# EAGLE design rf-synthesizer (EAGLE 7.5.0)
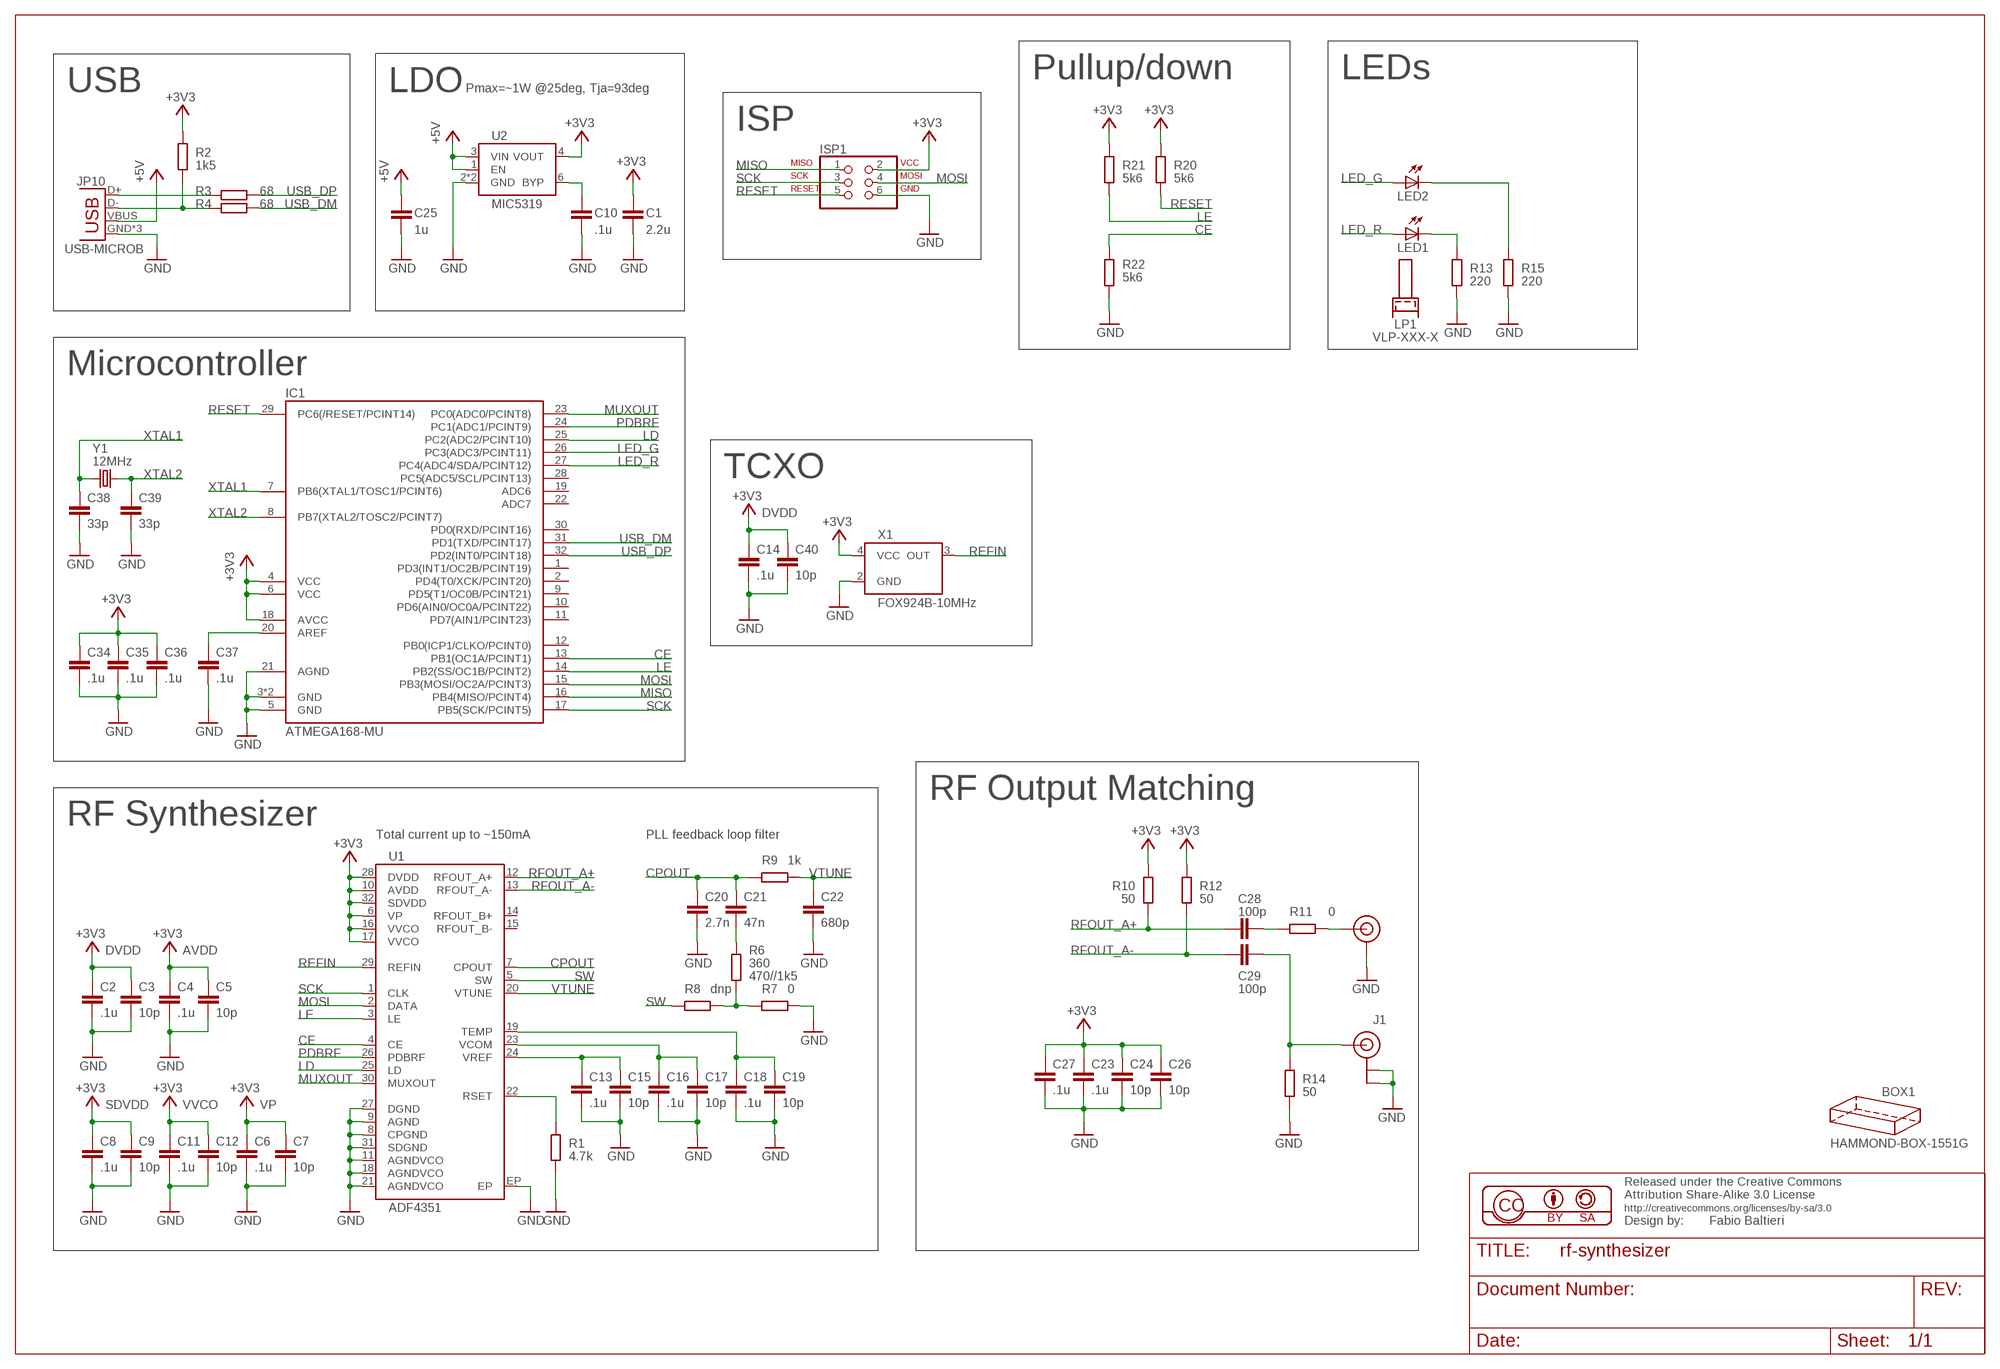
[diagram p0: schematic, sheet 1]

## Parts
BOX1  HAMMOND-BOX-1551G  [1551G]
C1  2.2u  C0603  [0603]
C2  .1u  C0603  [0603]
C3  10p  C0603  [0603]
C4  .1u  C0603  [0603]
C5  10p  C0603  [0603]
C6  .1u  C0603  [0603]
C7  10p  C0603  [0603]
C8  .1u  C0603  [0603]
C9  10p  C0603  [0603]
C10  .1u  C0603  [0603]
C11  .1u  C0603  [0603]
C12  10p  C0603  [0603]
C13  .1u  C0603  [0603]
C14  .1u  C0603  [0603]
C15  10p  C0603  [0603]
C16  .1u  C0603  [0603]
C17  10p  C0603  [0603]
C18  .1u  C0603  [0603]
C19  10p  C0603  [0603]
C20  2.7n  C0603  [0603]
C21  47n  C0603  [0603]
C22  680p  C0603  [0603]
C23  .1u  C0603  [0603]
C24  10p  C0603  [0603]
C25  1u  C0603  [0603]
C26  10p  C0603  [0603]
C27  .1u  C0603  [0603]
C28  100p  C0603  [0603]
C29  100p  C0603  [0603]
C34  .1u  C0603  [0603]
C35  .1u  C0603  [0603]
C36  .1u  C0603  [0603]
C37  .1u  C0603  [0603]
C38  33p  C0603  [0603]
C39  33p  C0603  [0603]
C40  10p  C0603  [0603]
IC1  ATMEGA168-MU  [MLF32-TH]
ISP1  ISP-AVR910PTH  [2X03]
J1  U.FL  [U.FL]
J$2  SMA_EDGEB  [SMA-EDGE-2]
JP10  USB-MICROB  [USB-MICROB]
LED1  LEDSML0805  [SML0805]
LED2  LEDSML0805  [SML0805]
LP1  VLP-XXX-X  [VLP-XXX-X]
R1  4.7k  R0603  [0603]
R2  1k5  R0603  [0603]
R3  68  R0603  [0603]
R4  68  R0603  [0603]
R6  360  R0603  [0603]
R7  0  R0603  [0603]
R8  dnp  R0603  [0603]
R9  1k  R0603  [0603]
R10  50  R0603  [0603]
R11  0  R0603  [0603]
R12  50  R0603  [0603]
R13  220  R0603  [0603]
R14  50  R0603  [0603]
R15  220  R0603  [0603]
R20  5k6  R0603  [0603]
R21  5k6  R0603  [0603]
R22  5k6  R0603  [0603]
U1  ADF4351  [LFCSP32]
U2  MIC5319  LDO-5PIN  [MLF6-2X2]
X1  FOX924B-10MHz  OSCILLATOR  [OSC-5X3.2]
Y1  12MHz  CRYSTAL5X3  [CRYSTAL-SMD-5X3]

## Nets
+3V3: C1.1 C2.1 C3.1 C4.1 C5.1 C6.1 C7.1 C8.1 C9.1 C11.1 C12.1 C14.1 C23.1 C24.1 C26.1 C27.1 C34.1 C35.1 C36.1 C40.1 IC1.4(VCC) IC1.6(VCC) IC1.18(AVCC) ISP1.2 R2.1 R10.1 R12.1 R20.1 R21.1 U1.6(VP) U1.10(AVDD) U1.16(VVCO) U1.17(VVCO) U1.28(DVDD) U1.32(SDVDD) U2.4(VOUT) X1.4(VCC)
+5V: C25.1 JP10.VBUS U2.1(EN) U2.3(VIN)
CE: IC1.13(PB1(OC1A/PCINT1)) R22.2 U1.4(CE)
CPOUT: C20.1 C21.1 R9.1 U1.7(CPOUT)
GND: C1.2 C2.2 C3.2 C4.2 C5.2 C6.2 C7.2 C8.2 C9.2 C10.2 C11.2 C12.2 C13.2 C14.2 C15.2 C16.2 C17.2 C18.2 C19.2 C20.2 C22.2 C23.2 C24.2 C25.2 C26.2 C27.2 C34.2 C35.2 C36.2 C37.2 C38.2 C39.2 C40.2 IC1.3(GND) IC1.5(GND) IC1.21(AGND) IC1.TH(GND) ISP1.6 J1.P$1(GND) J1.P$2(GND) J$2.M1(GND) J$2.M2(GND) J$2.M3(GND) J$2.M4(GND) JP10.GND JP10.MT1(GND) JP10.MT2(GND) R1.2 R7.2 R13.1 R14.2 R15.1 R22.1 U1.8(CPGND) U1.9(AGND) U1.11(AGNDVCO) U1.18(AGNDVCO) U1.21(AGNDVCO) U1.27(DGND) U1.31(SDGND) U1.EP U2.2(GND) U2.TH(GND) X1.2(GND)
LD: IC1.25(PC2(ADC2/PCINT10)) U1.25(LD)
LE: IC1.14(PB2(SS/OC1B/PCINT2)) R21.2 U1.3(LE)
LED_G: IC1.26(PC3(ADC3/PCINT11)) LED2.A
LED_R: IC1.27(PC4(ADC4/SDA/PCINT12)) LED1.A
MISO: IC1.16(PB4(MISO/PCINT4)) ISP1.1
MOSI: IC1.15(PB3(MOSI/OC2A/PCINT3)) ISP1.4 U1.2(DATA)
MUXOUT: IC1.23(PC0(ADC0/PCINT8)) U1.30(MUXOUT)
N$1: JP10.D+ R3.1
N$2: C28.2 R11.1
N$3: LED1.C R13.2
N$4: R1.1 U1.22(RSET)
N$5: R6.2 R7.1 R8.2
N$6: C21.2 R6.1
N$7: JP10.D- R2.2 R4.1
N$8: C10.1 U2.6(BYP)
N$9: J$2.FEED R11.2
N$10: LED2.C R15.2
N$12: C29.2 J1.P$3(SIGNAL) R14.1
N$14: C37.1 IC1.20(AREF)
PDBRF: IC1.24(PC1(ADC1/PCINT9)) U1.26(PDBRF)
REFIN: U1.29(REFIN) X1.3(OUT)
RESET: IC1.29(PC6(/RESET/PCINT14)) ISP1.5 R20.2
RFOUT_A+: C28.1 R10.2 U1.12(RFOUT_A+)
RFOUT_A-: C29.1 R12.2 U1.13(RFOUT_A-)
SCK: IC1.17(PB5(SCK/PCINT5)) ISP1.3 U1.1(CLK)
SW: R8.1 U1.5(SW)
TEMP: C18.1 C19.1 U1.19(TEMP)
USB_DM: IC1.31(PD1(TXD/PCINT17)) R4.2
USB_DP: IC1.32(PD2(INT0/PCINT18)) R3.2
VCOM: C16.1 C17.1 U1.23(VCOM)
VREF: C13.1 C15.1 U1.24(VREF)
VTUNE: C22.1 R9.2 U1.20(VTUNE)
XTAL1: C38.1 IC1.7(PB6(XTAL1/TOSC1/PCINT6)) Y1.1
XTAL2: C39.1 IC1.8(PB7(XTAL2/TOSC2/PCINT7)) Y1.3
Unconnected: IC1.1(PD3(INT1/OC2B/PCINT19)) IC1.2(PD4(T0/XCK/PCINT20)) IC1.9(PD5(T1/OC0B/PCINT21)) IC1.10(PD6(AIN0/OC0A/PCINT22)) IC1.11(PD7(AIN1/PCINT23)) IC1.12(PB0(ICP1/CLKO/PCINT0)) IC1.19(ADC6) IC1.22(ADC7) IC1.28(PC5(ADC5/SCL/PCINT13)) IC1.30(PD0(RXD/PCINT16)) U1.14(RFOUT_B+) U1.15(RFOUT_B-)

## Notes on the sheet
- Pullup/down | LEDs
- USB | LDO | Pmax=~1W @25deg, Tja=93deg
- ISP
- Microcontroller
- TCXO
- DVDD
- RF Output Matching
- RF Synthesizer
- Total current up to ~150mA | PLL feedback loop filter
- DVDD | AVDD
- 470//1k5
- SDVDD | VVCO | VP

## Library data of the parts
BOX1 = hammond:HAMMOND-BOX: Hammond Project boxes Hammond 1551 Transluscent Blue 50x35x20mm 1551GTBU http://www.hammondmfg.com/pdf/1551G.pdf Hammond 1551 Transluscent Blue 50x50x20mm 1551RTBU http://www.hammondmfg.com/pdf/1551R.pdf Hammond 1551 Transluscent Blue 60x35x20mm 1551HTBU http://www.hammondmfg.com/pdf/1551H.pdf Hammond 1551 Transluscent Blue 80x40x20mm 1551KTBU http://www.hammondmfg.com/pdf/1551K.pdf Hammond 1591 Transluscent Blue 100x51x22m m 1591XXATBU http://www.hammondmfg.com/pdf/1591XXA.pdf
C1-C29 C34-C40 = balto:C: Capacitor
IC1 = balto:ATMEGA168
ISP1 = balto:ISP-AVR910: PIN HEADER
J1 = SparkFun-Connectors:U.FL: SMD antenna connector- WRL-09144; PROD_ID: CONN-09193
J$2 = balto:SMA_EDGE: SMA Antenna Connector End launch SMA connector.
JP10 = SparkFun-Connectors:USB: USB Connectors USB-B-PTH is fully proven SKU : PRT-00139/CONN-08278 USB-miniB is fully proven SKU : PRT-00587 USB-A-PCB is untested. USB-A-H is throughly reviewed, but untested. Spark Fun Electronics SKU : PRT-00437 USB-B-SMT is throughly reviewed, but untested. Needs silkscreen touching up. USB-A-S has not been used/tested USB-MB-H has not been used/tested USB-MICROB has been used. CONN-09505; PROD_ID: CONN-09505
LED1 LED2 = led:LED: LED OSRAM: - CHIPLED LG R971, LG N971, LY N971, LG Q971, LY Q971, LO R971, LY R971 LH N974, LH R974 LS Q976, LO Q976, LY Q976 LO Q996 - Hyper CHIPLED LW Q18S LB Q993, LB Q99A, LB R99A - SideLED LS A670, LO A670, LY A670, LG A670, LP A670 LB A673, LV A673, LT A673, LW A673 LH A674 LY A675 LS A676, LA A676, LO A676, LY A676, LW A676 LS A679, LY A679, LG A679 - Hyper Micro SIDELED® LS Y876, LA Y876, LO Y876, LY Y876 LT Y87S - SmartLED LW L88C, LW L88S LB L89C, LB L89S, LG L890 LS L89K, LO L89K, LY L89K LS L896, LA L896, LO L896, LY L896 - TOPLED LS T670, LO T670, LY T670, LG T670, LP T670 LSG T670, LSP T670, LSY T670, LOP T670, LYG T670 LG T671, LOG T671, LSG T671 LB T673, LV T673, LT T673, LW T673 LH T674 LS T676, LA T676, LO T676, LY T676, LB T676, LH T676, LSB T676, LW T676 LB T67C, LV T67C, LT T67C, LS T67K, LO T67K, LY T67K, LW E67C LS E67B, LA E67B, LO E67B, LY E67B, LB E67C, LV E67C, LT E67C LW T67C LS T679, LY T679, LG T679 LS T770, LO T770, LY T770, LG T770, LP T770 LB T773, LV T773, LT T773, LW T773 LH T774 LS E675, LA E675, LY E675, LS T675 LS T776, LA T776, LO T776, LY T776, LB T776 LHGB T686 LT T68C, LB T68C - Hyper Mini TOPLED® LB M676 - Mini TOPLED Santana® LG M470 LS M47K, LO M47K, LY M47K Source: http://www.osram.convergy.de LUXEON: - LUMILED® LXK2-PW12-R00, LXK2-PW12-S00, LXK2-PW14-U00, LXK2-PW14-V00 LXK2-PM12-R00, LXK2-PM12-S00, LXK2-PM14-U00 LXK2-PE12-Q00, LXK2-PE12-R00, LXK2-PE12-S00, LXK2-PE14-T00, LXK2-PE14-U00 LXK2-PB12-K00, LXK2-PB12-L00, LXK2-PB12-M00, LXK2-PB14-N00, LXK2-PB14-P00, LXK2-PB14-Q00 LXK2-PR12-L00, LXK2-PR12-M00, LXK2-PR14-Q00, LXK2-PR14-R00 LXK2-PD12-Q00, LXK2-PD12-R00, LXK2-PD12-S00 LXK2-PH12-R00, LXK2-PH12-S00 LXK2-PL12-P00, LXK2-PL12-Q00, LXK2-PL12-R00 Source: www.luxeon.com KINGBRIGHT: KA-3528ASYC Source: www.kingbright.com
LP1 = balto:VLP-XXX-X: Bivar Light Pipe
R1-R4 R6-R15 R20-R22 = balto:R: Resistor
U1 = balto:ADF4351: Wideband Synthesizer with Integrated VCO
U2 = balto:LDO-5PIN: Generic 5 pin single fixed output LDO
X1 = balto:OSCILLATOR: Oscillator
Y1 = SparkFun-FreqCtrl:CRYSTAL: Various standard crystals. Proven footprints.; PROD_ID: XTAL-08218

## Board
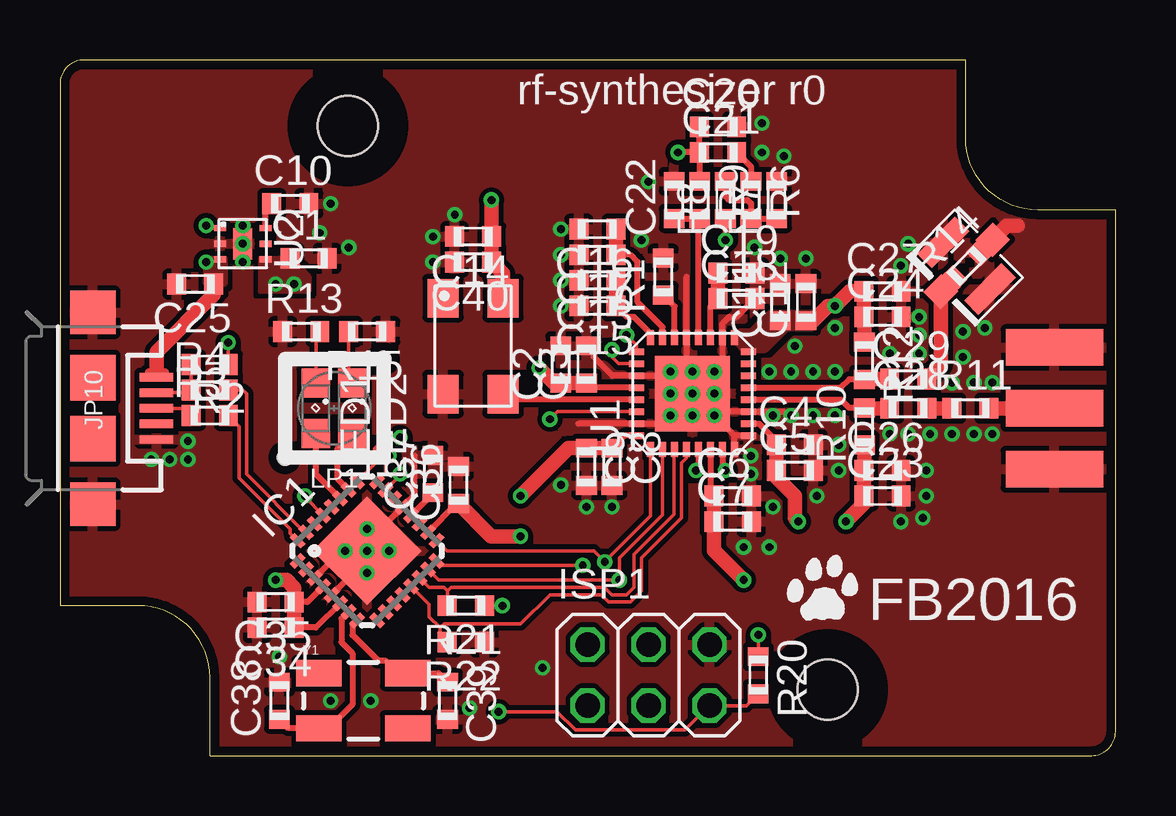
[diagram p1: board, top side]
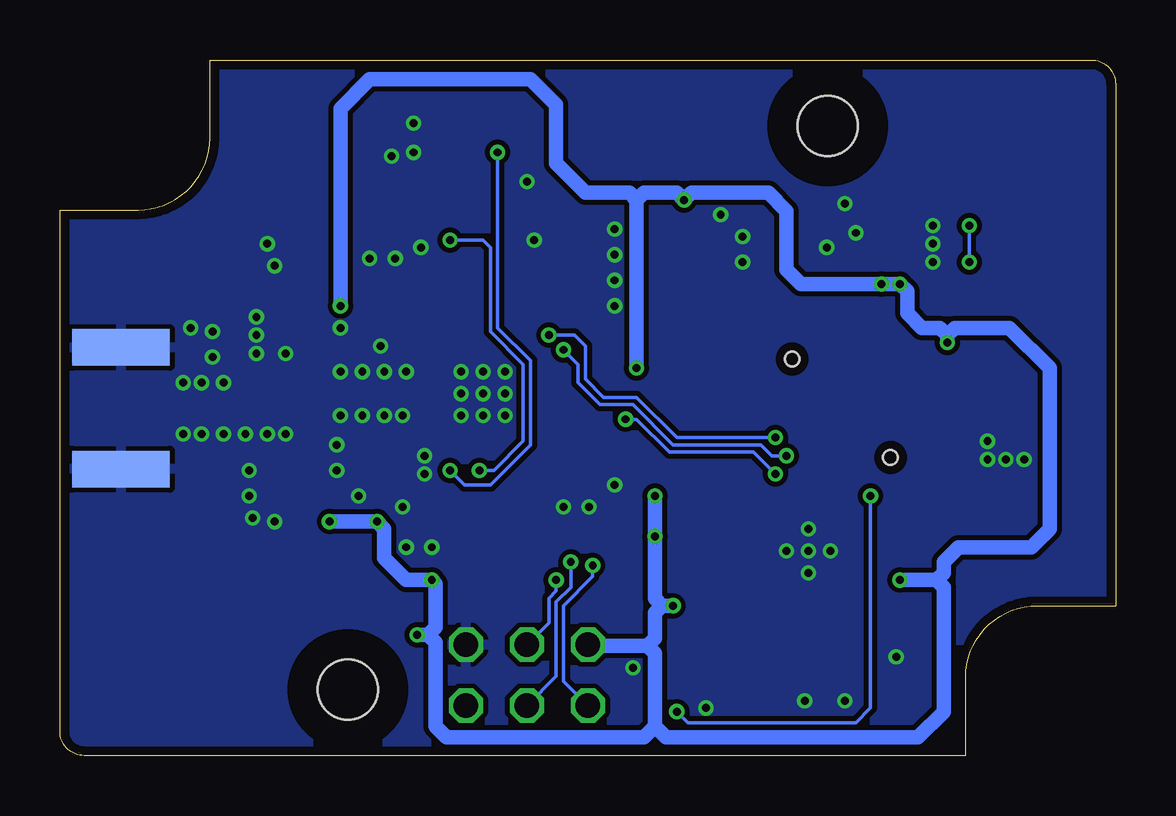
[diagram p2: board, bottom side, seen from below]

Size 44 x 29 mm. Coordinates in mm from the lower left corner, seen from the top.
Copper layers (1*16): Top 0.035mm / dielectric 1.5mm / Bottom 0.035mm
Design rules "balto": minimum track width 6mil, minimum drill 13mil, track to track 6mil, track to pad 6mil, pad to pad 6mil, via to via 6mil, smd to smd 6mil, copper to edge 15mil, drill to drill 6mil, minimum pad ring 6mil, minimum via ring 6mil, stop-mask expansion 2mil, vias tented up to drill 20mil, thermal gap 8mil

### Footprints (pad centres in the part's own frame; a part is rotated, then mirrored left to right if it is on the bottom)
1551G = hole 2.5: 32,2.75; 12,26.25
0603 = smd 0.787 x 0.864: 1 -0.774,0; 2 0.774,0
MLF32-TH = smd 0.65 x 0.29: 1 -2.35,1.75; 2 -2.35,1.25; 3 -2.35,0.75; 4 -2.35,0.25; 5 -2.35,-0.25; 6 -2.35,-0.75; 7 -2.35,-1.25; 8 -2.35,-1.75; 17 2.35,-1.75; 18 2.35,-1.25; 19 2.35,-0.75; 20 2.35,-0.25; 21 2.35,0.25; 22 2.35,0.75; 23 2.35,1.25; 24 2.35,1.75 | smd 0.29 x 0.65: 9 -1.75,-2.35; 10 -1.25,-2.35; 11 -0.75,-2.35; 12 -0.25,-2.35; 13 0.25,-2.35; 14 0.75,-2.35; 15 1.25,-2.35; 16 1.75,-2.35; 25 1.75,2.35; 26 1.25,2.35; 27 0.75,2.35; 28 0.25,2.35; 29 -0.25,2.35; 30 -0.75,2.35; 31 -1.25,2.35; 32 -1.75,2.35 | smd 3.2 x 3.2: TH 0,0
2X03 = drill 1.016 octagon: 1 -2.54,-1.27; 2 -2.54,1.27; 3 0,-1.27; 4 0,1.27; 5 2.54,-1.27; 6 2.54,1.27
U.FL = smd 2.2 x 0.85: P$1 0,1.375; P$2 0,-1.375 | smd 1.05 x 1: P$3 1.525,0; P$4 -1.525,0
SMA-EDGE-2 = smd 4.064 x 1.524: FEED 0,0; M1 0,-2.54; M4 0,2.54 | smd 4.064 x 1.524 bottom: M2 0,-2.54; M3 0,2.54
USB-MICROB = smd 0.35 x 1.4: D+ 0,2.65; D- -0.65,2.65; GND 1.3,2.65; ID 0.65,2.65; VBUS -1.3,2.65 | smd 1.8 x 1.9: MT1 -4,0; MT2 4,0 | smd 1.9 x 1.9: P$1 -1.27,0; P$2 1.27,0
SML0805 = smd 1.2 x 1.2: A 1.05,0; C -1.05,0
VLP-XXX-X = hole 0.6: -2.05,-2.05; 2.05,2.05
LFCSP32 = smd 0.63 x 0.28: 1 -2.335,1.75; 2 -2.335,1.25; 3 -2.335,0.75; 4 -2.335,0.25; 5 -2.335,-0.25; 6 -2.335,-0.75; 7 -2.335,-1.25; 8 -2.335,-1.75; 17 2.335,-1.75; 18 2.335,-1.25; 19 2.335,-0.75; 20 2.335,-0.25; 21 2.335,0.25; 22 2.335,0.75; 23 2.335,1.25; 24 2.335,1.75 | smd 0.28 x 0.63: 9 -1.75,-2.335; 10 -1.25,-2.335; 11 -0.75,-2.335; 12 -0.25,-2.335; 13 0.25,-2.335; 14 0.75,-2.335; 15 1.25,-2.335; 16 1.75,-2.335; 25 1.75,2.335; 26 1.25,2.335; 27 0.75,2.335; 28 0.25,2.335; 29 -0.25,2.335; 30 -0.75,2.335; 31 -1.25,2.335; 32 -1.75,2.335 | smd 3.14 x 3.14: EP 0,0
MLF6-2X2 = smd 0.26 x 0.5: 1 -0.65,-0.95; 2 0,-0.95; 3 0.65,-0.95; 4 0.65,0.95; 5 0,0.95; 6 -0.65,0.95 | smd 1.3 x 0.8: TH 0,0
OSC-5X3.2 = smd 1.6 x 1.3: 1 -2,-1.25; 2 2,-1.25; 3 2,1.25; 4 -2,1.25
CRYSTAL-SMD-5X3 = smd 1.9 x 1.1: 1 -1.85,-1.15; 2 1.85,-1.15; 3 1.85,1.15; 4 -1.85,1.15

### Placement (x,y rotation side)
BOX1  0,0 0 top
C1  10.36,20.73 0 top
C2  20.88,16.31 90 top
C3  21.95,16.31 90 top
C4  30.63,12.95 0 top
C5  30.63,11.89 0 top
C6  28.04,10.82 0 top
C7  28.04,9.75 0 top
C8  23.01,12.04 270 top
C9  21.95,12.04 270 top
C10  9.6,23.01 0 top
C11  30.02,18.9 90 top
C12  31.09,18.9 90 top
C13  22.4,19.81 180 top
C14  17.22,21.64 180 top
C15  22.4,18.75 180 top
C16  22.4,21.95 180 top
C17  22.4,20.88 180 top
C18  28.19,19.05 0 top
C19  28.19,20.12 0 top
C20  27.43,26.21 0 top
C21  27.43,25.15 0 top
C22  25.6,23.16 90 top
C23  34.29,10.82 0 top
C24  34.29,18.29 0 top
C25  5.64,19.66 180 top
C26  34.29,11.89 0 top
C27  34.29,19.35 0 top
C28  35.36,14.48 0 top
C29  35.36,15.7 0 top
C34  8.99,5.33 180 top
C35  8.99,6.4 180 top
C36  16.61,11.28 90 top
C37  15.54,11.73 90 top
C38  9.14,2.29 90 top
C39  16.15,2.29 270 top
C40  17.22,20.57 180 top
IC1  12.8,8.53 45 top
ISP1  24.54,3.35 0 top
J1  37.8,20.42 225 top
J$2  41.45,14.48 0 top
JP10  1.37,14.48 270 top
LED1  10.67,14.48 270 top
LED2  12.19,14.48 270 top
LP1  11.43,14.48 180 top
R1  25.15,19.96 90 top
R2  6.25,16.31 180 top
R3  6.25,14.17 0 top
R4  6.25,15.24 0 top
R6  28.8,23.16 270 top
R7  29.87,23.16 90 top
R8  27.74,23.16 90 top
R9  26.67,23.16 270 top
R10  33.53,13.72 90 top
R11  37.95,14.48 0 top
R12  33.53,16.46 270 top
R13  10.06,17.68 0 top
R14  37.8,20.42 45 top
R15  12.8,17.68 180 top
R20  29.11,3.35 270 top
R21  16.92,6.25 180 top
R22  16.92,4.72 180 top
U1  26.37,15.09 90 top
U2  7.62,21.34 270 top
U$1  [CAT-L]  31.85,6.55 0 top
X1  17.22,17.07 270 top
Y1  12.65,2.29 0 top

### Tracks (layer width: path | path; a pad name or v marks a point on that pad's centre or on a via)
+3V3  (via drill 0.33)
  Top 0.152: R21.1 v18.44,6.25 | R20.1 v29.11,5.03 | R2.1 v7.01,17.22
  Top 0.254: U1.10 29.14,13.84 29.86,13.12 C4.1 | U1.6 27.11,10.97 C6.1 | U1.28 22.14,15.34 C3.1 | U1.32 23.54,13.34 C8.1 | IC1.4 10.31,6.4 C35.1 | IC1.6 10.66,5.33 C34.1 | IC1.18 16.54,10.5 C36.1
  Top 0.61: R12.1 33.53,18.28 C24.1 C27.1 32.92,19.36 v32.31,18.75 32,18.75 31.38,18.12 C12.1 | R10.1 C26.1 C23.1 33.52,10.5 v32.77,9.75 | C4.1 C5.1 29.86,11.6 30.63,10.82 30.63,9.91 v30.79,9.75 | C6.1 C7.1 27.27,8.55 v28.5,7.32 | C8.1 C9.1 21.2,12.81 v19.2,10.82 | C3.1 C2.1 20.59,15.53 v19.96,16.15 | X1.4 18.47,20.1 C40.1 C14.1 17.98,21.65 v17.98,23.16 | C34.1 C35.1 9.77,7 9.45,7.32 v8.99,7.32 | C36.1 17.97,9.14 v19.2,9.14
  Bottom 0.61: 19.96,23.16 19.66,23.47 18.29,23.47 v17.98,23.16 17.68,23.47 14.48,23.47 13.72,22.71 13.72,20.27 13.11,19.66 v9.75,19.66 v8.99,19.66 8.69,19.36 8.69,18.44 8.08,17.83 7.32,17.83 7.01,17.53 | 19.96,23.16 20.27,23.47 22.1,23.47 23.32,24.69 23.32,27.13 24.38,28.19 31.09,28.19 32.31,26.98 v32.31,18.75 | 19.96,23.16 v19.96,16.15 | 19.2,1.22 18.75,0.76 8.23,0.76 7.16,1.83 7.16,7.01 7.47,7.32 | 19.2,1.22 19.66,0.76 27.89,0.76 28.35,1.22 28.35,4.72 28.65,5.03 | v19.2,10.82 v19.2,9.14 19.2,6.55 18.9,6.25 | 18.9,6.25 19.2,5.94 19.2,4.88 19.51,4.57 | 19.51,4.57 19.2,4.27 19.2,1.22 | 28.65,5.03 28.35,5.33 28.35,7.16 v28.5,7.32 29.57,7.32 30.48,8.23 30.48,9.45 v30.79,9.75 v32.77,9.75 | 28.65,5.03 v29.11,5.03 | 18.9,6.25 v18.44,6.25 | 19.51,4.57 21.95,4.57 ISP1.2 | 7.47,7.32 7.16,7.62 7.16,8.08 6.55,8.69 3.5,8.69 2.74,9.45 2.74,16.15 4.42,17.83 6.71,17.83 7.01,17.53 | 7.47,7.32 v8.99,7.32 | v7.01,17.22 7.01,17.53
  pour Top (no thermals): 28.19,17.22 28.5,16.92 29.41,16.92 30.33,17.83 31.39,17.83 31.39,18.44 29.57,18.44 28.8,17.68 28.35,17.68 28.19,17.53
  pour Top (no thermals): 8.38,19.35 8.38,20.73 9.6,20.73 10.36,19.96 10.36,19.35
+5V  (via drill 0.33)
  Top 0.152: U2.1 6.21,21.99 v6.1,22.1
  Top 0.254: 4.02,16 4.42,16 4.42,15.78 JP10.VBUS 4.02,16 | 4.02,16 3.66,16 3.66,15.85
  Top 0.61: 4.02,16 4.02,16.82 6.41,19.21 C25.1
  Bottom 0.152: v6.1,22.1 v6.1,20.57
  pour Top (no thermals): 6.86,20.73 6.86,19.66 6.1,19.66 6.1,20.42 6.4,20.73
CE
  Top 0.152: U1.4 26.11,12.4 25.91,12.19 25.91,9.91 24.23,8.23 24.23,6.86 23.77,6.4 22.86,6.4 22.55,6.71 20.42,6.71 19.2,5.49 16,5.49 15.85,5.33 | IC1.13 15.39,6.3 15.39,5.79 15.85,5.33 | 15.85,5.33 15.85,5.02 R22.2
CPOUT  (via drill 0.33)
  Top 0.254: U1.7 27.61,12.01 v27.74,11.89 | R9.1 26.67,25.13 C21.1 | C21.1 C20.1 | C21.1 v25.76,25.15
  Bottom 0.152: v25.76,25.15 25.76,17.83 24.38,16.46 24.38,12.95 26.06,11.28 27.13,11.28 v27.74,11.89
GND  (via drill 0.33)
  Top 0.254: U1.8 28.11,13.34 | 28.11,13.34 27.74,13.72 | U1.9 28.11,13.34 | 26.11,19.96 U1.21 26.11,16.46 26.36,16.21 v26.36,16 | 21.61,13.84 U1.31 24.99,13.84 25.33,14.17 v25.45,14.17 | IC1.3 11.74,8.53 v11.89,8.53 | IC1.5 12.24,7.62 v12.8,7.62 | v12.8,9.45 13.36,9.45 IC1.21 14.78,10.87 14.78,12.5 | v25.45,16 25.16,16 24.99,15.84 U1.27 23.02,15.84 22.25,16.61 22.25,16.76 | v27.28,16 27.28,16.12 27.61,16.46 U1.18 27.61,18.01 27.89,18.29 28.21,18.29 C18.2 | v27.28,14.17 27.44,14.34 U1.11 30.16,14.34 30.18,14.33
  Top 0.61: R14.2 39.47,22.1 39.93,22.1
  other vias: 26.37,15.09 26.37,14.17 25.45,15.09 27.28,15.09 12.8,8.53 13.72,8.53 7.62,21.34 7.62,22.1 7.62,20.57 12.95,2.29 11.28,2.29 32.31,17.83 29.57,16 29.72,14.17 32.31,14.17 32.31,16 31.39,16 31.39,14.17 30.48,14.17 30.48,16 34.59,13.41 34.59,16.76 35.81,16.76 36.27,13.41 37.19,13.41 37.19,15.54 38.86,13.41 38.86,15.54 38.1,15.54 38.1,13.41 37.64,16.61 37.64,17.68 35.81,18.29 35.36,13.41 35.81,17.53 3.81,12.34 4.57,12.34 5.33,12.34 5.33,13.11 28.5,8.69 29.72,10.36 29.57,8.69 31.55,10.82 32.46,12.95 32.46,11.89 36.12,11.89 36.12,10.82 35.05,9.75 35.97,9.91 28.8,12.5 28.8,11.73 35.05,20.42 30.63,17.07 28.96,21.18 30.02,20.73 31.09,20.73 20.88,21.95 20.88,20.88 20.88,19.81 20.88,18.75 24.23,21.49 15.54,21.64 15.54,20.57 16.46,22.56 11.28,23.01 12.04,21.18 20.12,3.66 9.14,4.11 38.56,17.83 35.36,21.34 21.95,10.36 23.01,10.36 20.88,11.28 24.54,23.93 29.26,26.37 29.26,25.15 30.18,24.99 10.82,21.79 17.07,1.98
  pour Top (isolate 0.203, rank 2): -2.54,-2.54 46.99,-2.54 46.99,31.75 -2.54,31.75
  pour Bottom (isolate 0.203): -1.27,-1.27 45.72,-1.27 45.72,30.48 -1.27,30.48
LD  (via drill 0.33)
  Top 0.152: U1.25 24.03,17.12 v23.62,17.53 | IC1.25 13.11,12.16 13.11,12.8 13.56,13.26 v14.17,13.26
  Bottom 0.152: v14.17,13.26 18.29,13.26 19.96,14.94 21.34,14.94 22.1,15.7 22.1,17.07 22.55,17.53 v23.62,17.53
LE
  Top 0.152: U1.3 25.6,12.74 25.6,10.06 23.93,8.38 23.93,7.01 23.62,6.71 23.01,6.71 22.71,7.01 16.31,7.01 16.15,6.86 | IC1.14 15.39,7.01 16,7.01 16.15,6.86 | 16.15,6.86 16.15,6.26 R21.2
LED_G
  Top 0.254: IC1.26 11.58,11.52 11.58,12.82 LED2.A
LED_R
  Top 0.254: IC1.27 10.67,11.73 LED1.A
MISO  (via drill 0.33)
  Top 0.152: IC1.16 15.89,7.92 v21.79,7.92
  Bottom 0.152: ISP1.1 23.01,3.1 23.01,6.25 21.79,7.47 v21.79,7.92
MOSI  (via drill 0.33)
  Top 0.152: U1.2 25.11,10.03 23.32,8.23 v23.32,7.32 15.79,7.32 IC1.15
  Bottom 0.152: v23.32,7.32 23.32,6.86 23.62,6.55 23.62,5.54 ISP1.4
MUXOUT  (via drill 0.33)
  Top 0.152: U1.30 20.74,14.34 v20.42,14.02 | IC1.23 14.17,11.67 v14.17,11.73
  Bottom 0.152: v14.17,11.73 15.09,12.65 18.59,12.65 19.96,14.02 v20.42,14.02
N$1
  Top 0.152: JP10.D+ 5.17,14.48 R3.1
N$2
  Top 0.61: C28.2 R11.1
N$3
  Top 0.152: LED1.C 10.67,17.51 R13.2
N$4
  Top 0.254: U1.22 25.61,18.72 R1.1
N$5
  Top 0.254: R7.1 R6.2 28.8,23.01 28.65,23.16 27.89,23.16 27.74,23.32 R8.2
N$6
  Top 0.254: C21.2 28.8,24.55 R6.1
N$7
  Top 0.152: JP10.D- 5.36,15.13 R4.1 R2.2
N$8
  Top 0.254: U2.6 8.57,22.76 C10.1
N$9
  Top 0.61: J$2.FEED R11.2
N$10
  Top 0.152: LED2.C 12.03,15.69 R15.2
N$12
  Top 0.61: C29.2 36.72,16.28 J1.P$3 R14.1
N$14
  Top 0.254: IC1.20 15.54,10.92 C37.1
PDBRF  (via drill 0.33)
  Top 0.152: U1.26 23.29,16.34 23.01,16.61 v23.01,16.92 | IC1.24 13.56,11.77 13.56,12.34 v13.72,12.5
  Bottom 0.152: v13.72,12.5 14.33,12.5 14.78,12.95 18.44,12.95 20.12,14.63 21.49,14.63 22.4,15.54 22.4,16.31 v23.01,16.92
REFIN
  Top 0.254: U1.29 18.7,14.84 X1.3
RESET  (via drill 0.33)
  Top 0.152: R20.2 28.61,2.08 ISP1.5 26.06,1.07 21.49,1.07 20.73,1.83 v18.29,1.83 | IC1.29 10.21,10.77 v10.21,10.82
  Bottom 0.152: v10.21,10.82 10.21,1.98 10.82,1.37 17.83,1.37 v18.29,1.83
RFOUT_A+
  Top 0.254: U1.12 32.56,14.84 32.91,14.49 R10.2
  Top 0.61: C28.1 33.54,14.48 R10.2
RFOUT_A-
  Top 0.254: U1.13 32.56,15.34 32.91,15.69 R12.2
  Top 0.61: C29.1 33.54,15.7 R12.2
SCK  (via drill 0.33)
  Top 0.152: U1.1 24.61,9.98 v22.71,8.08 22.25,8.53 16.12,8.53 IC1.17
  Bottom 0.152: ISP1.3 23.32,3.3 23.32,6.4 22.71,7.01 v22.71,8.08
SW  (via drill 0.33)
  Top 0.254: R8.1 v27.74,21.49 | U1.5 26.61,11.98 v26.52,11.89
  Bottom 0.152: v27.74,21.49 26.36,21.49 26.06,21.18 26.06,17.68 24.69,16.31 24.69,13.11 25.91,11.89 v26.52,11.89
TEMP
  Top 0.254: U1.19 27.11,18.75 C18.1
  Top 0.61: C18.1 C19.1
USB_DM
  Top 0.152: IC1.31 10.2,9.31 7.77,11.73 7.77,15.09 7.62,15.24 R4.2
USB_DP
  Top 0.152: IC1.32 9.6,9.26 9.6,9.45 7.47,11.58 7.47,13.72 R3.2
VCOM
  Top 0.254: U1.23 25.11,17.86 24.08,18.9 24.08,20.57 23.77,20.88 C17.1
  Top 0.61: C17.1 C16.1
VREF
  Top 0.254: U1.24 24.61,17.6 23.93,18.29 23.63,18.29 C15.1
  Top 0.61: C15.1 C13.1
VTUNE
  Top 0.254: U1.20 26.61,22.34 R9.2 C22.1
XTAL1
  Top 0.254: IC1.7 11.73,5.7 11.73,4.72 12.19,4.27 12.19,2.13 11.19,1.14 Y1.1 9.52,1.14 C38.1
XTAL2
  Top 0.254: IC1.8 12.19,5.45 12.19,5.03 13.26,3.96 13.56,3.96 14.09,3.44 Y1.3 15.78,3.44 C39.1

### Text on the board
_tsilk: rf-synthesizer r0 | FB2016